# EAGLE schematic rauschsimulator_V4 (EAGLE 6.6.0)
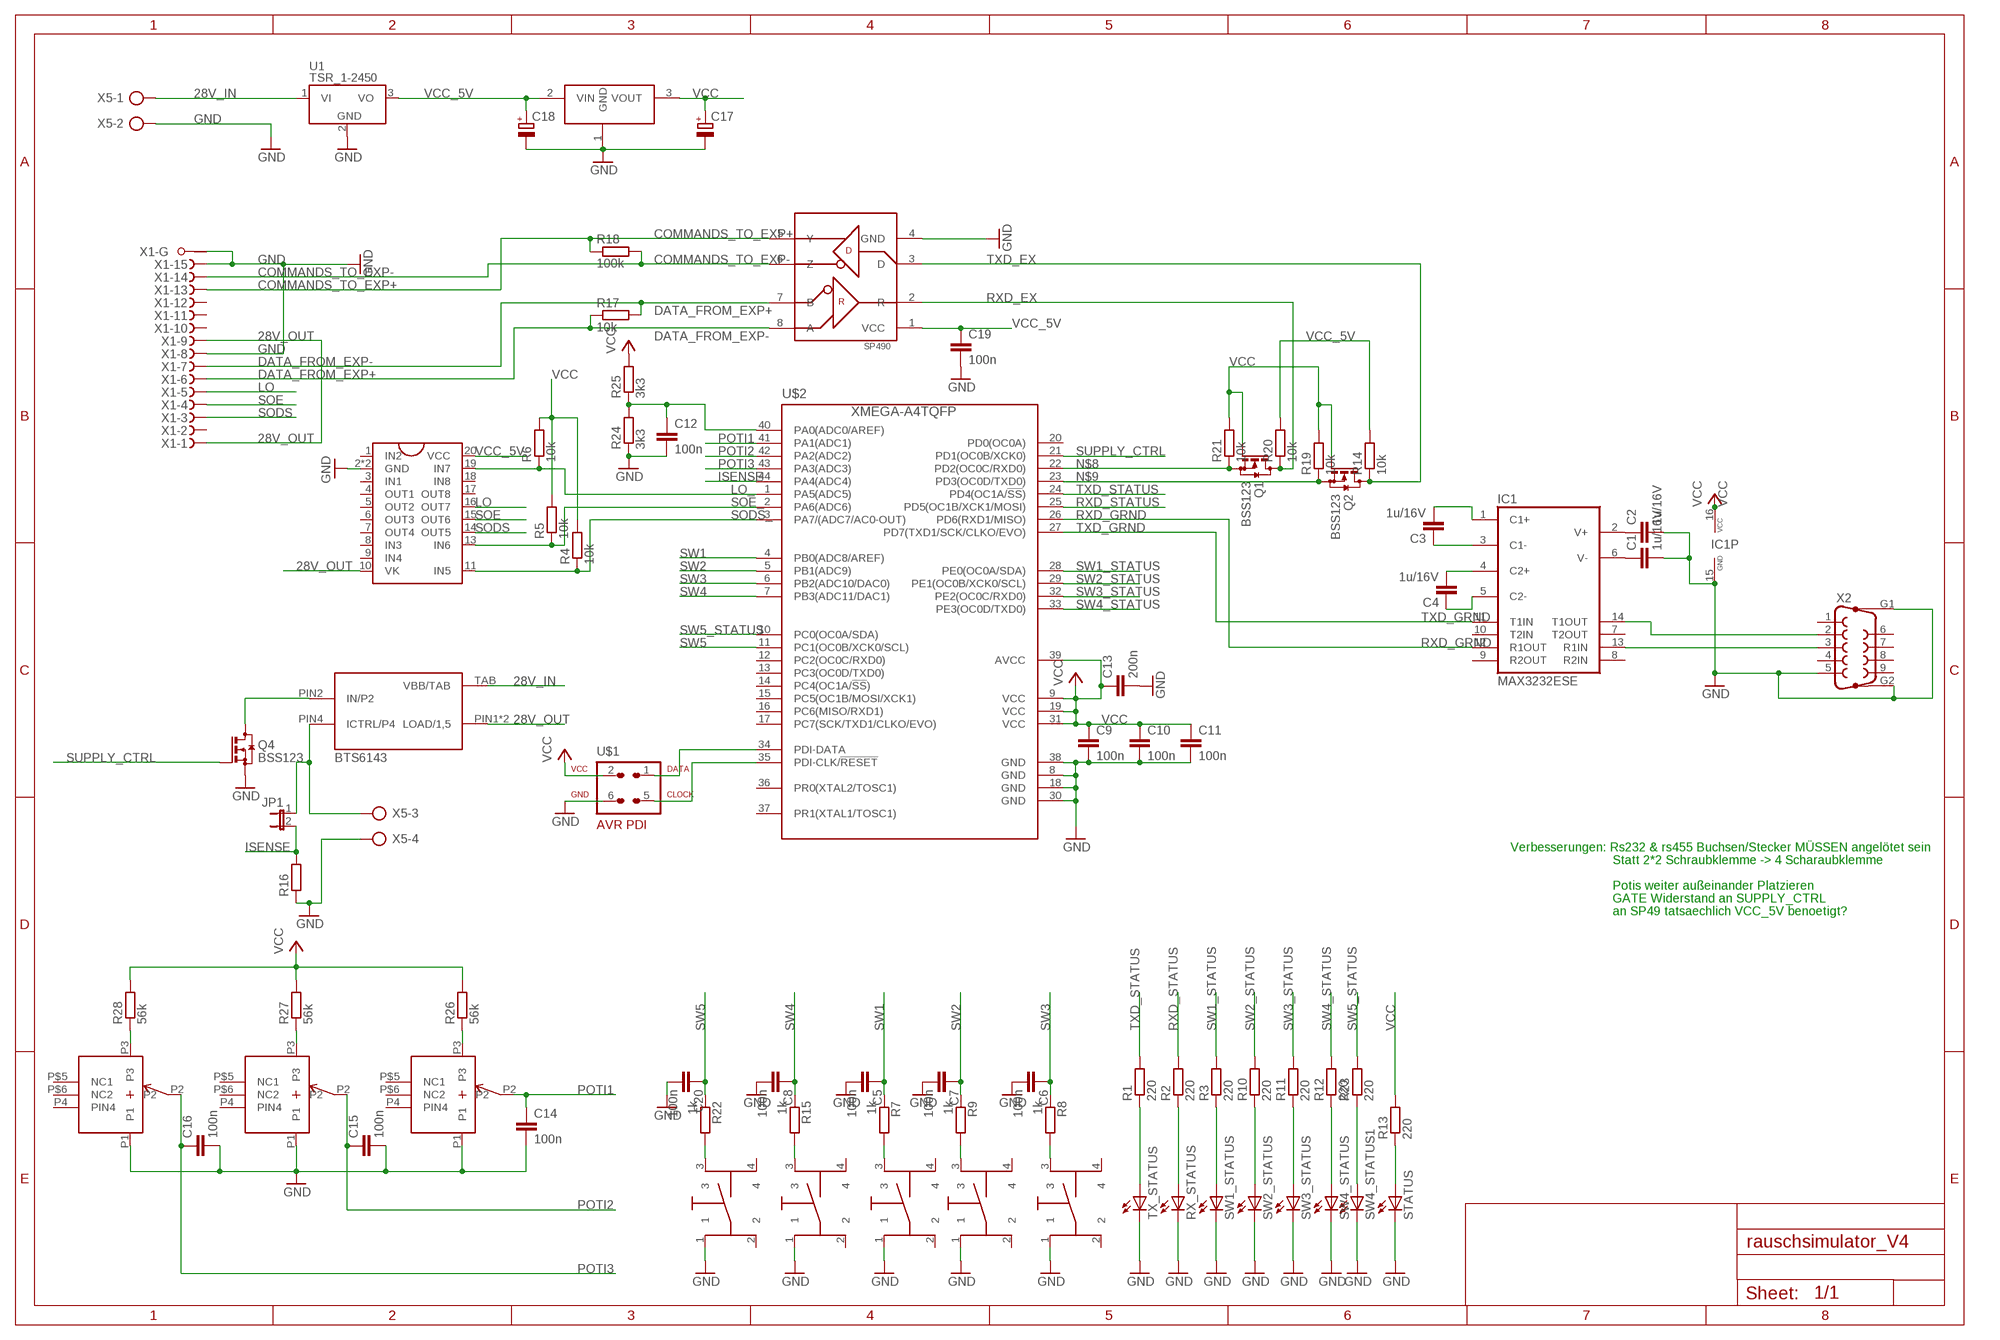
[diagram p0: schematic, sheet 1]

## Parts
C1  1u/16V  C-EUC0603K  [C0603K]
C2  1u/16V  C-EUC0603K  [C0603K]
C3  1u/16V  C-EUC0603K  [C0603K]
C4  1u/16V  C-EUC0603K  [C0603K]
C5  100n  C-EUC0603K  [C0603K]
C6  100n  C-EUC0603K  [C0603K]
C7  100n  C-EUC0603K  [C0603K]
C8  100n  C-EUC0603K  [C0603K]
C9  100n  C-EUC0603K  [C0603K]
C10  100n  C-EUC0603K  [C0603K]
C11  100n  C-EUC0603K  [C0603K]
C12  100n  C-EUC0603K  [C0603K]
C13  200n  C-EUC0603K  [C0603K]
C14  100n  C-EUC0603K  [C0603K]
C15  100n  C-EUC0603K  [C0603K]
C16  100n  C-EUC0603K  [C0603K]
C17  CPOL-EUE2.5-6  [E2,5-6]
C18  CPOL-EUE2.5-6  [E2,5-6]
C19  100n  C-EUC0603K  [C0603K]
C20  100n  C-EUC0603K  [C0603K]
IC1  MAX3232ESE  [SO16]
JP1  JP1E  [JP1]
Q1  BSS123  [SOT23]
Q2  BSS123  [SOT23]
Q4  BSS123  [SOT23]
R1  220  R-EU_R0603  [R0603]
R2  220  R-EU_R0603  [R0603]
R3  220  R-EU_R0603  [R0603]
R4  10k  R-EU_R0603  [R0603]
R5  10k  R-EU_R0603  [R0603]
R6  10k  R-EU_R0603  [R0603]
R7  1k  R-EU_R0603  [R0603]
R8  1k  R-EU_R0603  [R0603]
R9  1k  R-EU_R0603  [R0603]
R10  220  R-EU_R0603  [R0603]
R11  220  R-EU_R0603  [R0603]
R12  220  R-EU_R0603  [R0603]
R13  220  R-EU_R0603  [R0603]
R14  10k  R-EU_R0603  [R0603]
R15  1k  R-EU_R0603  [R0603]
R16  R-EU_0617/22  [0617/22]
R17  10k  R-EU_R0603  [R0603]
R18  100k  R-EU_R0603  [R0603]
R19  10k  R-EU_R0603  [R0603]
R20  10k  R-EU_R0603  [R0603]
R21  10k  R-EU_R0603  [R0603]
R22  1k  R-EU_R0603  [R0603]
R23  220  R-EU_R0603  [R0603]
R24  3k3  R-EU_R0603  [R0603]
R25  3k3  R-EU_R0603  [R0603]
R26  56k  R-EU_R0603  [R0603]
R27  56k  R-EU_R0603  [R0603]
R28  56k  R-EU_R0603  [R0603]
RX_STATUS  LEDCHIPLED_1206  [CHIPLED_1206]
STATUS  LEDCHIPLED_1206  [CHIPLED_1206]
SW1  SMS_IP67  [IP67]
SW1_STATUS  LEDCHIPLED_1206  [CHIPLED_1206]
SW2  SMS_IP67  [IP67]
SW2_STATUS  LEDCHIPLED_1206  [CHIPLED_1206]
SW3  SMS_IP67  [IP67]
SW3_STATUS  LEDCHIPLED_1206  [CHIPLED_1206]
SW4  SMS_IP67  [IP67]
SW4_STATUS  LEDCHIPLED_1206  [CHIPLED_1206]
SW4_STATUS1  LEDCHIPLED_1206  [CHIPLED_1206]
SW5  SMS_IP67  [IP67]
TX_STATUS  LEDCHIPLED_1206  [CHIPLED_1206]
U1  TSR_1-2450  [TSR-1]
U$1  AVR-PDIVERT  [AVR-ISP-6]
U$2  XMEGA-A4TQFP  [TQFP44]
U$3  STRK11K  [VERT_POTI]
U$4  STRK11K  [VERT_POTI]
U$5  STRK11K  [VERT_POTI]
U$13  LM1117  [TO252]
U$14  BTS6143  [TO-252-5-1]
U$15  UDN2596  [DIL20]
U$16  SP490  [SO08]
X1  F15HPS  [F15HP]
X2  F09HP  [F09HP]
X5  AK500/4  [AK500/4]

## Nets
28V_IN: U1.1(VI) U$14.TAB(VBB/TAB) X5.1
28V_OUT: U$14.PIN1(LOAD/1,5) U$14.PIN5(LOAD/1,5) U$15.10(VK) X1.1(-1:F) X1.9(-9:F)
COMMANDS_TO_EXP+: R18.1 U$16.5(Y) X1.13(-13:F)
COMMANDS_TO_EXP-: R18.2 U$16.6(Z) X1.14(-14:F)
DATA_FROM_EXP+: R17.1 U$16.8(A) X1.6(-6:F)
DATA_FROM_EXP-: R17.2 U$16.7(B) X1.7(-7:F)
GND: C1.2 C2.2 C5.2 C6.2 C7.2 C8.2 C9.2 C10.2 C11.2 C12.2 C13.2 C14.2 C15.2 C16.2 C17.- C18.- C19.2 C20.2 IC1.15(GND) Q4.2(S) R16.1 R24.1 RX_STATUS.C STATUS.C SW1.1 SW1_STATUS.C SW2.1 SW2_STATUS.C SW3.1 SW3_STATUS.C SW4.1 SW4_STATUS1.C SW4_STATUS.C SW5.1 TX_STATUS.C U1.2(GND) U$1.6 U$2.8(GND) U$2.18(GND) U$2.30(GND) U$2.38(GND) U$3.P1 U$4.P1 U$5.P1 U$13.1(GND) U$15.2(GND) U$15.12(GND) U$16.4(GND) X1.8(-8:F) X1.15(-15:F) X1.G1(-G:G1) X2.5 X2.G1 X2.G2 X5.2 X5.4
ISENSE: JP1.2 R16.2 U$2.44(PA4(ADC4))
LO: U$15.16(OUT7) X1.5(-5:F)
LO_: R6.1 U$2.1(PA5(ADC5)) U$15.19(IN7)
N$1: C1.1 IC1.6(V-)
N$2: C2.1 IC1.2(V+)
N$3: C4.2 IC1.4(C2+)
N$4: C4.1 IC1.5(C2-)
N$5: C3.1 IC1.3(C1-)
N$6: C3.2 IC1.1(C1+)
N$7: U$1.1 U$2.34(PDI-DATA)
N$8: Q1.2(S) R21.1 U$2.22(PD2(OC0C/RXD0))
N$9: Q2.2(S) R19.1 U$2.23(PD3(OC0D/TXD0))
N$10: IC1.13(R1IN) X2.3
N$11: R26.1 U$5.P3
N$12: C12.1 R24.2 R25.1 U$2.40(PA0(ADC0/AREF))
N$13: R8.2 SW1.3
N$14: IC1.14(T1OUT) X2.2
N$15: R9.2 SW2.3
N$16: R7.2 SW3.3
N$17: U$1.5 U$2.35(PDI-CLK/!RESET)
N$18: Q4.3(D) U$14.PIN2(IN/P2)
N$20: R10.1 SW2_STATUS.A
N$21: R1.1 TX_STATUS.A
N$22: R2.1 RX_STATUS.A
N$23: R3.1 SW1_STATUS.A
N$24: R11.1 SW3_STATUS.A
N$25: R12.1 SW4_STATUS.A
N$26: R13.1 STATUS.A
N$27: R15.2 SW4.3
N$35: R23.1 SW4_STATUS1.A
N$36: JP1.1 U$14.PIN4(ICTRL/P4) X5.3
N$37: R27.1 U$4.P3
N$38: R22.2 SW5.3
N$39: R28.1 U$3.P3
POTI1: C14.1 U$2.41(PA1(ADC1)) U$5.P2
POTI2: C15.1 U$2.42(PA2(ADC2)) U$4.P2
POTI3: C16.1 U$2.43(PA3(ADC3)) U$3.P2
RXD_EX: Q1.3(D) R20.1 U$16.2(R)
RXD_GRND: IC1.12(R1OUT) U$2.26(PD6(RXD1/MISO))
RXD_STATUS: R2.2 U$2.25(PD5(OC1B/XCK1/MOSI))
SODS: U$15.14(OUT5) X1.3(-3:F)
SODS_: R4.1 U$2.3(PA7/(ADC7/AC0-OUT)) U$15.11(IN5)
SOE: U$15.15(OUT6) X1.4(-4:F)
SOE_: R5.1 U$2.2(PA6(ADC6)) U$15.13(IN6)
SUPPLY_CTRL: Q4.1(G) U$2.21(PD1(OC0B/XCK0))
SW1: C5.1 R7.1 U$2.4(PB0(ADC8/AREF))
SW1_STATUS: R3.2 U$2.28(PE0(OC0A/SDA))
SW2: C7.1 R9.1 U$2.5(PB1(ADC9))
SW2_STATUS: R10.2 U$2.29(PE1(OC0B/XCK0/SCL))
SW3: C6.1 R8.1 U$2.6(PB2(ADC10/DAC0))
SW3_STATUS: R11.2 U$2.32(PE2(OC0C/RXD0))
SW4: C8.1 R15.1 U$2.7(PB3(ADC11/DAC1))
SW4_STATUS: R12.2 U$2.33(PE3(OC0D/TXD0))
SW5: C20.1 R22.1 U$2.11(PC1(OC0B/XCK0/SCL))
SW5_STATUS: R23.2 U$2.10(PC0(OC0A/SDA))
TXD_EX: Q2.3(D) R14.1 U$16.3(D)
TXD_GRND: IC1.11(T1IN) U$2.27(PD7(TXD1/SCK/CLKO/EVO))
TXD_STATUS: R1.2 U$2.24(PD4(OC1A/!SS!))
VCC: C9.1 C10.1 C11.1 C13.1 C17.+ IC1.16(VCC) Q1.1(G) Q2.1(G) R4.2 R5.2 R6.2 R13.2 R19.2 R21.2 R25.2 R26.2 R27.2 R28.2 U$1.2 U$2.9(VCC) U$2.19(VCC) U$2.31(VCC) U$2.39(AVCC) U$13.3(VOUT)
VCC_5V: C18.+ C19.1 R14.2 R20.2 U1.3(VO) U$13.2(VIN) U$15.20(VCC) U$16.1(VCC)
Unconnected: IC1.7(T2OUT) IC1.8(R2IN) IC1.9(R2OUT) IC1.10(T2IN) SW1.2 SW1.4 SW2.2 SW2.4 SW3.2 SW3.4 SW4.2 SW4.4 SW5.2 SW5.4 U$2.12(PC2(OC0C/RXD0)) U$2.13(PC3(OC0D/TXD0)) U$2.14(PC4(OC1A/!SS!)) U$2.15(PC5(OC1B/MOSI/XCK1)) U$2.16(PC6(MISO/RXD1)) U$2.17(PC7(SCK/TXD1/CLKO/EVO)) U$2.20(PD0(OC0A)) U$2.36(PR0(XTAL2/TOSC1)) U$2.37(PR1(XTAL1/TOSC1)) U$3.P4(PIN4) U$3.P$5(NC1) U$3.P$6(NC2) U$4.P4(PIN4) U$4.P$5(NC1) U$4.P$6(NC2) U$5.P4(PIN4) U$5.P$5(NC1) U$5.P$6(NC2) U$15.1(IN2) U$15.3(IN1) U$15.4(OUT1) U$15.5(OUT2) U$15.6(OUT3) U$15.7(OUT4) U$15.8(IN3) U$15.9(IN4) U$15.17(OUT8) U$15.18(IN8) X1.2(-2:F) X1.10(-10:F) X1.11(-11:F) X1.12(-12:F) X1.G2(-G:G2) X2.1 X2.4 X2.6 X2.7 X2.8 X2.9

## Notes on the sheet
- BTS6143
- Verbesserungen: Rs232 & rs455 Buchsen/Stecker MÜSSEN angelötet sein
- Statt 2*2 Schraubklemme -> 4 Scharaubklemme
- Potis weiter außeinander Platzieren
- GATE Widerstand an SUPPLY_CTRL
- an SP49 tatsaechlich VCC_5V benoetigt?

## Library data of the parts
C1-C16 C19 C20 = rcl:C-EU: CAPACITOR, European symbol
C17 C18 = resistor:CPOL-EU: POLARIZED CAPACITOR, European symbol
IC1 = maxim:MAX3232*: True RS-232 Transceivers 3.0V to 5.5V, Low-Power up to 1Mbps, Using Four 0.1µF External Capacitors Source: http://pdfserv.maxim-ic.com/en/ds/MAX3222-MAX3241.pdf; MF: MAXIM; MPN: MAX3232ESE; OC_FARNELL: 9725539; OC_NEWARK: 79C3880
JP1 = jumper:JP1E: JUMPER
Q1 Q2 Q4 = transistor-small-signal:BSS123: N-CHANNEL MOS FET
R1-R28 = rcl:R-EU_: RESISTOR, European symbol
RX_STATUS STATUS SW1_STATUS SW2_STATUS SW3_STATUS SW4_STATUS SW4_STATUS1 TX_STATUS = led:LED: LED OSRAM: - CHIPLED LG R971, LG N971, LY N971, LG Q971, LY Q971, LO R971, LY R971 LH N974, LH R974 LS Q976, LO Q976, LY Q976 LO Q996 - Hyper CHIPLED LW Q18S LB Q993, LB Q99A, LB R99A - SideLED LS A670, LO A670, LY A670, LG A670, LP A670 LB A673, LV A673, LT A673, LW A673 LH A674 LY A675 LS A676, LA A676, LO A676, LY A676, LW A676 LS A679, LY A679, LG A679 - Hyper Micro SIDELED® LS Y876, LA Y876, LO Y876, LY Y876 LT Y87S - SmartLED LW L88C, LW L88S LB L89C, LB L89S, LG L890 LS L89K, LO L89K, LY L89K LS L896, LA L896, LO L896, LY L896 - TOPLED LS T670, LO T670, LY T670, LG T670, LP T670 LSG T670, LSP T670, LSY T670, LOP T670, LYG T670 LG T671, LOG T671, LSG T671 LB T673, LV T673, LT T673, LW T673 LH T674 LS T676, LA T676, LO T676, LY T676, LB T676, LH T676, LSB T676, LW T676 LB T67C, LV T67C, LT T67C, LS T67K, LO T67K, LY T67K, LW E67C LS E67B, LA E67B, LO E67B, LY E67B, LB E67C, LV E67C, LT E67C LW T67C LS T679, LY T679, LG T679 LS T770, LO T770, LY T770, LG T770, LP T770 LB T773, LV T773, LT T773, LW T773 LH T774 LS E675, LA E675, LY E675, LS T675 LS T776, LA T776, LO T776, LY T776, LB T776 LHGB T686 LT T68C, LB T68C - Hyper Mini TOPLED® LB M676 - Mini TOPLED Santana® LG M470 LS M47K, LO M47K, LY M47K Source: http://www.osram.convergy.de LUXEON: - LUMILED® LXK2-PW12-R00, LXK2-PW12-S00, LXK2-PW14-U00, LXK2-PW14-V00 LXK2-PM12-R00, LXK2-PM12-S00, LXK2-PM14-U00 LXK2-PE12-Q00, LXK2-PE12-R00, LXK2-PE12-S00, LXK2-PE14-T00, LXK2-PE14-U00 LXK2-PB12-K00, LXK2-PB12-L00, LXK2-PB12-M00, LXK2-PB14-N00, LXK2-PB14-P00, LXK2-PB14-Q00 LXK2-PR12-L00, LXK2-PR12-M00, LXK2-PR14-Q00, LXK2-PR14-R00 LXK2-PD12-Q00, LXK2-PD12-R00, LXK2-PD12-S00 LXK2-PH12-R00, LXK2-PH12-S00 LXK2-PL12-P00, LXK2-PL12-Q00, LXK2-PL12-R00 Source: www.luxeon.com KINGBRIGHT: KA-3528ASYC Source: www.kingbright.com
SW1-SW5 = SMSIp67:SMS_IP67: Großer Tastschalter Taster Switch Schalter
U1 = _traco_tsr-1:TSR_1-*: TRACO TSR-1 Series Point-of-Load DC/DC-Converters Vi max. 36 V; Vo = (1.2 .. 15)V ±2%; Io = 0 .. 1 A SIP-Package (drop-in replacement for 78xx linear voltage regulators in TO220-package, vertically assembled) Source: www.tracopower.com Technologies: TSR 1- Vi (V) Vo (V) ±2% Io = 0 .. 1 A 24_ ( generic ) 2412 4.6 .. 36 1.2 2415 4.6 .. 36 1.5 2418 4.6 .. 36 1.8 2425 4.6 .. 36 2.5 2433 4.75.. 36 3.3 2450 6.5 .. 36 5.0 2465 9.0 .. 36 6.5 2490 12 .. 36 9.0 24120 15 .. 36 12 24150 18 .. 36 15 Author: Dipl.-Ing. FH Rainer Bayer HHN Hochschule Heilbronn, rainer.bayer@hs-heilbronn.de Ingenieurbüro ing-rb, mail@ing-rb.de
U$1 = avr-7:AVR-PDI: AVR PDI programming interface connector
U$2 = avr-7:XMEGA-A4: Atmel XMega A4 series processor
U$3-U$5 = poti:STRK11K: Potentiometer
U$13 = LM1117:LM1117
U$14 = BTS6134:BTS6143
U$15 = UDN2596:UDN2596
U$16 = SP491:SP490
X1 = con-subd:F15HPS: SUB-D; OC_FARNELL: unknown; OC_NEWARK: unknown
X2 = con-subd:F09HP: SUB-D; OC_FARNELL: unknown; OC_NEWARK: unknown
X5 = con-ptr500:AK500/4: CONNECTOR; OC_FARNELL: unknown; OC_NEWARK: unknown